# Altium schematic sheet COMPLETE_SLAVE_BMS.SchDoc
size A4; Organization: Waterloop; Address1: 200 University Ave W; Address2: Engineering 5, 1104; Address3: Waterloo, ON; Address4: N2L 3G1; SheetNumber: 1; SheetTotal: 5
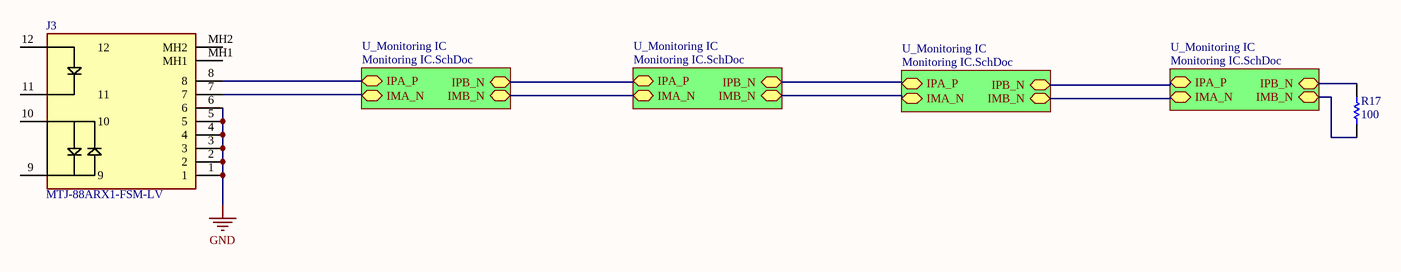
[diagram p0: COMPLETE_SLAVE_BMS.SchDoc]

## Parts
J3  MTJ-88ARX1-FSM-LV  [MTJ-88ARX1-FSM-LV]
R17  value 100  [0603 - Resistor]  (hidden comment: Resistor)

## Sub-sheets
U_Monitoring IC = Monitoring IC.SchDoc: IMA_N (bidir), IPA_P (bidir), IMB_N (bidir), IPB_N (bidir)
U_Monitoring IC = Monitoring IC.SchDoc: IMA_N (bidir), IPA_P (bidir), IMB_N (bidir), IPB_N (bidir)
U_Monitoring IC = Monitoring IC.SchDoc: IMA_N (bidir), IPA_P (bidir), IMB_N (bidir), IPB_N (bidir)
U_Monitoring IC = Monitoring IC.SchDoc: IMA_N (bidir), IPA_P (bidir), IMB_N (bidir), IPB_N (bidir)

## Nets
GND: J3.1 J3.2 J3.3 J3.4 J3.5 J3.6
NetJ3_7: J3.7 ; sheet U_Monitoring IC/IMA_N
NetJ3_8: J3.8 ; sheet U_Monitoring IC/IPA_P
NetR17_1: R17.1 ; sheet U_Monitoring IC/IMB_N
NetR17_2: R17.2 ; sheet U_Monitoring IC/IPB_N
(unnamed): sheet U_Monitoring IC/IMB_N, sheet U_Monitoring IC/IMA_N
(unnamed): sheet U_Monitoring IC/IPB_N, sheet U_Monitoring IC/IPA_P
(unnamed): sheet U_Monitoring IC/IMB_N, sheet U_Monitoring IC/IMA_N
(unnamed): sheet U_Monitoring IC/IPB_N, sheet U_Monitoring IC/IPA_P
(unnamed): sheet U_Monitoring IC/IMB_N, sheet U_Monitoring IC/IMA_N
(unnamed): sheet U_Monitoring IC/IPB_N, sheet U_Monitoring IC/IPA_P

Not connected (* = marked no-connect by the designer): J3 9 10 11 12 MH1 MH2

## Notes on the sheet
- Title:
- Size:
- Date:
- A4
- Author:
- Revision:
- Sheet
- of
- File:

## Library data of the parts
J3 = MTJ-88ARX1-FSM-LV: RJ45 Connector
R17 = Resistor: Rating: *; Manufacturer Part Number: *; Manufacturer: *; Supplier Part Number: *; Supplier: *